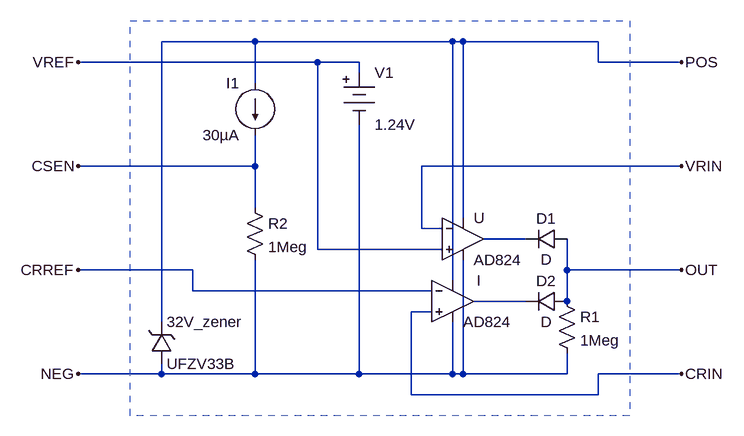
[diagram p0: schematic TSM101.asc]
TSM101.asc, the LTspice schematic file:
Version 4
SHEET 1 2016 3572
WIRE 1248 448 1104 448
WIRE 1552 448 1248 448
WIRE 1568 448 1552 448
WIRE 1776 448 1568 448
WIRE 1344 480 976 480
WIRE 1408 480 1344 480
WIRE 1776 480 1776 448
WIRE 1904 480 1776 480
WIRE 1408 496 1408 480
WIRE 1248 512 1248 448
WIRE 1248 640 1248 592
WIRE 1248 640 976 640
WIRE 1904 640 1504 640
WIRE 1248 704 1248 640
WIRE 1568 720 1568 448
WIRE 1504 736 1504 640
WIRE 1536 736 1504 736
WIRE 1664 752 1600 752
WIRE 1344 768 1344 480
WIRE 1536 768 1344 768
WIRE 1152 800 976 800
WIRE 1728 800 1728 752
WIRE 1904 800 1728 800
WIRE 1552 816 1552 448
WIRE 1152 832 1152 800
WIRE 1520 832 1152 832
WIRE 1664 848 1584 848
WIRE 1728 848 1728 800
WIRE 1520 864 1488 864
WIRE 1104 880 1104 448
WIRE 1104 960 1104 944
WIRE 1104 960 976 960
WIRE 1248 960 1248 784
WIRE 1248 960 1104 960
WIRE 1408 960 1408 576
WIRE 1408 960 1248 960
WIRE 1552 960 1552 880
WIRE 1552 960 1408 960
WIRE 1568 960 1568 784
WIRE 1568 960 1552 960
WIRE 1728 960 1728 928
WIRE 1728 960 1568 960
WIRE 1904 960 1776 960
WIRE 1488 992 1488 864
WIRE 1776 992 1776 960
WIRE 1776 992 1488 992
FLAG 976 480 VREF
FLAG 976 960 NEG
FLAG 1904 640 VRIN
FLAG 976 640 CSEN
FLAG 1904 960 CRIN
FLAG 1904 480 POS
FLAG 1904 800 OUT
FLAG 976 800 CRREF
SYMBOL diode 1728 736 R90
WINDOW 0 0 32 VBottom 2
WINDOW 3 32 32 VTop 2
SYMATTR InstName D1
SYMBOL diode 1728 832 R90
WINDOW 0 0 32 VBottom 2
WINDOW 3 32 32 VTop 2
SYMATTR InstName D2
SYMBOL Misc\\battery 1408 480 R0
WINDOW 123 0 0 Left 0
WINDOW 39 0 0 Left 0
SYMATTR InstName V1
SYMATTR Value 1.24V
SYMBOL zener 1088 944 M180
WINDOW 0 24 64 Left 2
WINDOW 3 24 0 Left 2
SYMATTR InstName 32V_zener
SYMATTR Value UFZV33B
SYMATTR Description Diode
SYMATTR Type diode
SYMBOL Opamps\\AD824 1568 688 R0
SYMATTR InstName U
SYMBOL Opamps\\AD824 1552 784 R0
WINDOW 0 37 32 Left 2
SYMATTR InstName I
SYMBOL res 1712 832 R0
SYMATTR InstName R1
SYMATTR Value 1Meg
SYMBOL res 1232 688 R0
SYMATTR InstName R2
SYMATTR Value 1Meg
SYMBOL current 1248 512 M0
WINDOW 123 0 0 Left 0
WINDOW 39 0 0 Left 0
SYMATTR InstName I1
SYMATTR Value 30µA
RECTANGLE Normal 1824 1024 1056 416 2

The netlist it stands for:
* TSM101.asc
D1 OUT N001 D
D2 OUT N002 D
V1 VREF NEG 1.24V
D§32V_zener NEG POS UFZV33B
XU VREF VRIN POS NEG N001 AD824  ; pins In+ In- V+ V- OUT
XI CRIN CRREF POS NEG N002 AD824  ; pins In+ In- V+ V- OUT
R1 OUT NEG 1Meg
R2 CSEN NEG 1Meg
I1 POS CSEN 30µA
.model D D
.lib standard.dio
.backanno
.end